# EAGLE schematic ep-pannel (EAGLE 5.07)
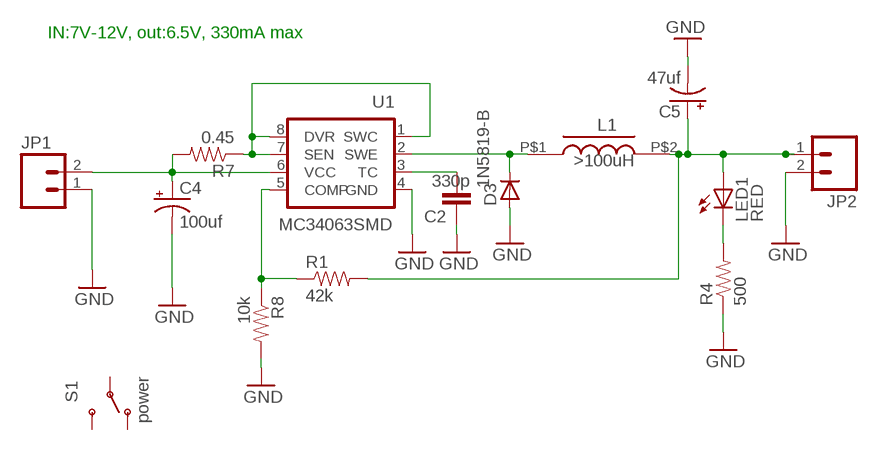
[diagram p0: schematic, sheet 1]

## Parts
C2  330p  CAP0805  [0805]
C4  100uf  CAP_POL7343  [EIA7343]
C5  47uf  CAP_POL7343  [EIA7343]
D3  1N5819-B  DIODESMA  [SMA-DIODE]
JP1  CON-02-XH  [XH-1X2-LONG-LOCK]
JP2  CON-02-XH  [XH-1X2-LONG-LOCK]
L1  >100uH  INDUCTOR-I-CD75  [CD75]
LED1  RED  LED3MM  [LED3MM]
R1  42k  RESISTOR0805  [0805]
R4  500  RESISTOR1/4W  [AXIAL-0.3]
R7  0.45  RESISTOR0805  [0805]
R8  10k  RESISTOR0805  [0805]
S1  power  SWITCH-SPST3AM6  [SWITCH-SPDT-AM#6]
U1  MC34063SMD  [SO08]

## Nets
GND: C2.1 C4.C(-) C5.C(-) D3.A JP1.1 JP2.2 R4.P$1 R8.2 U1.4(GND)
N$1: C2.2 U1.3(TC)
N$2: C4.A(+) JP1.2 R7.2 U1.6(VCC)
N$3: R1.1 R8.1 U1.5(COMP)
N$5: LED1.K(C) R4.P$2
N$6: D3.C L1.P$1 U1.2(SWE)
N$7: C5.A(+) JP2.1 L1.P$2 LED1.A R1.2
N$8: R7.1 U1.1(SWC) U1.7(SEN) U1.8(DVR)
Unconnected: S1.1(O) S1.2(P) S1.3(S)

## Notes on the sheet
- IN:7V-12V, out:6.5V, 330mA max

## Library data of the parts
C2 = SparkFun:CAP: Capacitor Standard 0603 ceramic capacitor, and 0.1" leaded capacitor.
C4 C5 = SparkFun:CAP_POL: Capacitor Polarized These are standard SMD and PTH capacitors. Normally 10uF, 47uF, and 100uF in electrolytic and tantalum varieties. Always verify the external diameter of the through hole cap, it varies with capacity, voltage, and manufacturer. The EIA devices should be standard.
D3 = digital-toy:DIODE: Diode These are standard reverse protection diodes and small signal diodes. SMA package can handle up to about 1A. SOD-323 can handle about 200mA. What the SOD-323 package when ordering, there are some mfgs out there that are 5-pin packages.
JP1 JP2 = digital-toy:CON-02: Header 2 Standard 2-pin 0.1" header. Use with straight break away headers (SKU : PRT-00116), right angle break away headers (PRT-00553), swiss pins (PRT-00743), machine pins (PRT-00117), and female headers (PRT-00115). Molex polarized connector foot print use with SKU : PRT-08233 with associated crimp pins and housings.
L1 = digital-toy:INDUCTOR-I: Inductors with Iron
LED1 = SparkFun:LED: LEDs Standard schematic elements and footprints for 5mm, 3mm, 1206, and 0603 sized LEDs. 5mm - Spark Fun Electronics SKU : COM-00529 (and others)
R1 R4 R7 R8 = digital-toy:RESISTOR: Resistor Basic schematic elements and footprints for 0603, 1206, and PTH 1/10th watt (small) resistors. digital-toy copy vertical mount of axial-0.3 from rcl.lbr : the 0207/xx
S1 = digital-toy:SWITCH-SPST: SPST Switch Simple slide switch. Spark Fun Electronics SKU : COM-00102
U1 = digital-toy:MC34063: digital toy dip8-l smd